# Altium schematic sheet Multiply_2.SchDoc
size A; SheetNumber: 8; SheetTotal: 8
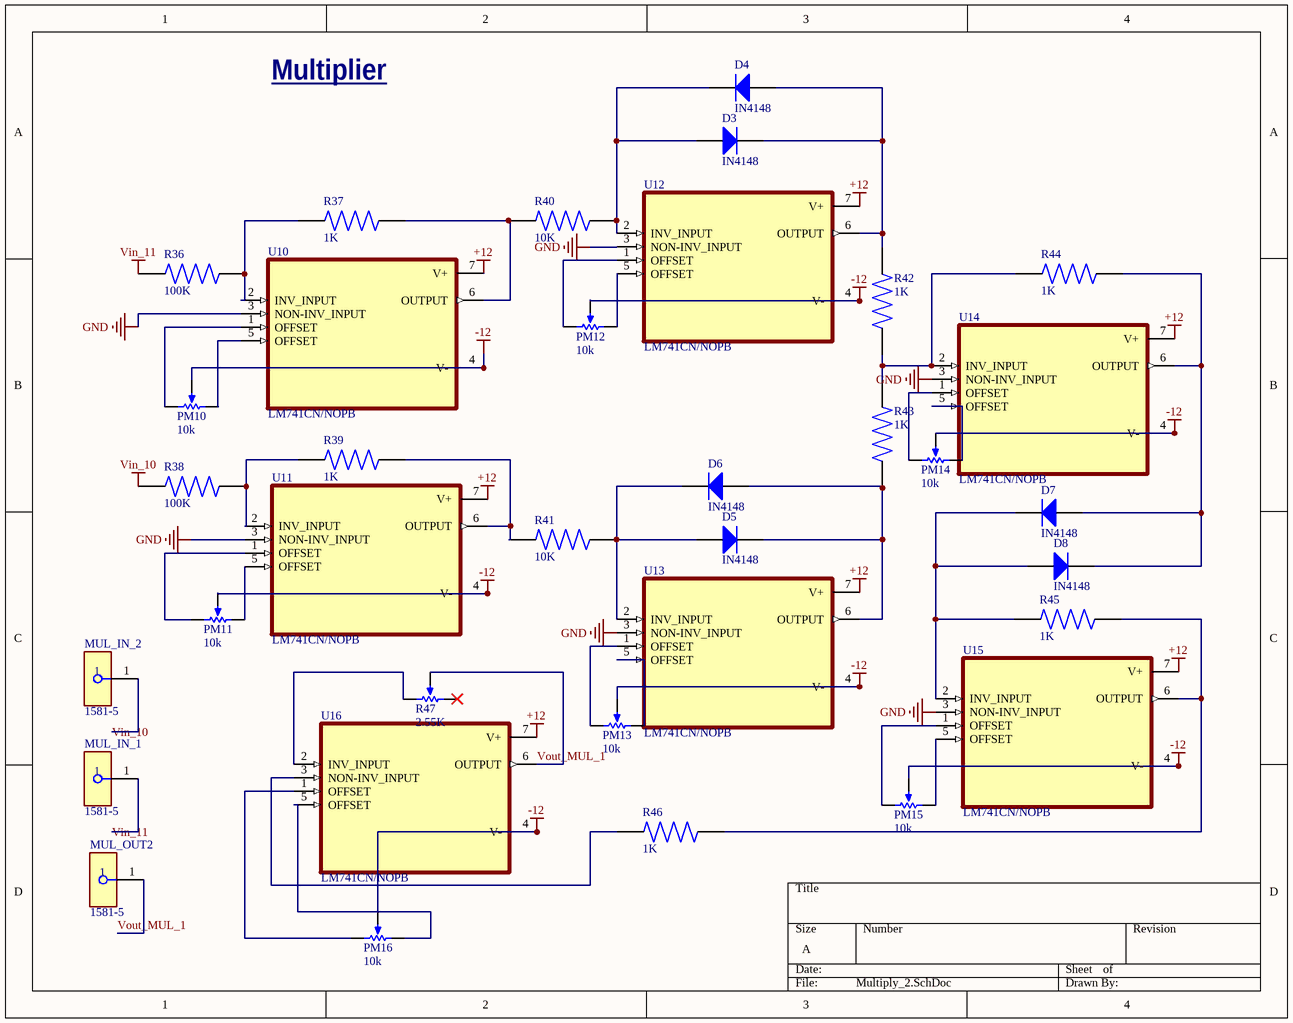
[diagram p0: Multiply_2.SchDoc]

## Parts
D3  IN4148  [PCBComponent_1]
D4  IN4148  [PCBComponent_1]
D5  IN4148  [PCBComponent_1]
D6  IN4148  [PCBComponent_1]
D7  IN4148  [PCBComponent_1]
D8  IN4148  [PCBComponent_1]
MUL_IN_1  1581-5  [FP-1581-5-MFG]
MUL_IN_2  1581-5  [FP-1581-5-MFG]
MUL_OUT2  1581-5  [FP-1581-5-MFG]
PM10  10k  [BOUR-3362P]
PM11  10k  [BOUR-3362P]
PM12  10k  [BOUR-3362P]
PM13  10k  [BOUR-3362P]
PM14  10k  [BOUR-3362P]
PM15  10k  [BOUR-3362P]
PM16  10k  [BOUR-3362P]
R36  100K  [RESAD1100W55L680D260]
R37  1K  [RESAD1100W55L680D260]
R38  100K  [RESAD1100W55L680D260]
R39  1K  [RESAD1100W55L680D260]
R40  10K  [RESAD1100W55L680D260]
R41  10K  [RESAD1100W55L680D260]
R42  1K  [RESAD1100W55L680D260]
R43  1K  [RESAD1100W55L680D260]
R44  1K  [RESAD1100W55L680D260]
R45  1K  [RESAD1100W55L680D260]
R46  1K  [RESAD1100W55L680D260]
R47  2.55K  [BOUR-3852A-282-103AL-3_V]
U10  LM741CN/NOPB  [DIP794W45P254L959H508Q8]
U11  LM741CN/NOPB  [DIP794W45P254L959H508Q8]
U12  LM741CN/NOPB  [DIP794W45P254L959H508Q8]
U13  LM741CN/NOPB  [DIP794W45P254L959H508Q8]
U14  LM741CN/NOPB  [DIP794W45P254L959H508Q8]
U15  LM741CN/NOPB  [DIP794W45P254L959H508Q8]
U16  LM741CN/NOPB  [DIP794W45P254L959H508Q8]

## Nets
+12: U10.7(V+) U11.7(V+) U12.7(V+) U13.7(V+) U14.7(V+) U15.7(V+) U16.7(V+)
-12: PM10.2(S) PM11.2(S) PM12.2(S) PM13.2(S) PM14.2(S) PM15.2(S) PM16.1(CCW) PM16.2(S) U10.4(V-) U11.4(V-) U12.4(V-) U13.4(V-) U14.4(V-) U15.4(V-) U16.4(V-) U16.5(OFFSET)
GND: U10.3(NON-INV_INPUT) U11.3(NON-INV_INPUT) U12.3(NON-INV_INPUT) U13.3(NON-INV_INPUT) U14.3(NON-INV_INPUT) U15.3(NON-INV_INPUT)
Vin_10: MUL_IN_2.1 R38.1
Vin_11: MUL_IN_1.1 R36.1
Vout_MUL_1: MUL_OUT2.1 R47.2(S) U16.6(OUTPUT)
NetD3_1: D3.1(K) D4.2(A) R42.1 U12.6(OUTPUT)
NetD3_2: D3.2(A) D4.1(K) R40.2 U12.2(INV_INPUT)
NetD5_1: D5.1(K) D6.2(A) R43.1 U13.6(OUTPUT)
NetD5_2: D5.2(A) D6.1(K) R41.2 U13.2(INV_INPUT)
NetD7_1: D7.1(K) D8.2(A) R45.1 U15.2(INV_INPUT)
NetD7_2: D7.2(A) D8.1(K) R44.2 U14.6(OUTPUT)
NetPM10_1: PM10.1(CCW) U10.5(OFFSET)
NetPM10_3: PM10.3(CW) U10.1(OFFSET)
NetPM11_1: PM11.1(CCW) U11.5(OFFSET)
NetPM11_3: PM11.3(CW) U11.1(OFFSET)
NetPM12_1: PM12.1(CCW) U12.5(OFFSET)
NetPM12_3: PM12.3(CW) U12.1(OFFSET)
NetPM13_1: PM13.1(CCW) U13.5(OFFSET)
NetPM13_3: PM13.3(CW) U13.1(OFFSET)
NetPM14_1: PM14.1(CCW) U14.5(OFFSET)
NetPM14_3: PM14.3(CW) U14.1(OFFSET)
NetPM15_1: PM15.1(CCW) U15.5(OFFSET)
NetPM15_3: PM15.3(CW) U15.1(OFFSET)
NetPM16_3: PM16.3(CW) U16.1(OFFSET)
NetR36_2: R36.2 R37.1 U10.2(INV_INPUT)
NetR37_2: R37.2 R40.1 U10.6(OUTPUT)
NetR38_2: R38.2 R39.1 U11.2(INV_INPUT)
NetR39_2: R39.2 R41.1 U11.6(OUTPUT)
NetR42_2: R42.2 R43.2 R44.1 U14.2(INV_INPUT)
NetR45_2: R45.2 R46.2 U15.6(OUTPUT)
NetR46_1: R46.1 U16.3(NON-INV_INPUT)
NetR47_3: R47.3(CW) U16.2(INV_INPUT)

Not connected (* = marked no-connect by the designer): R47 1(CCW)*

## Notes on the sheet
- Multiplier

## Library data of the parts
D3-D8 = Component_1
MUL_IN_1 MUL_IN_2 MUL_OUT2 = CMP-73906-000011-1: CONN BANANA JACK TURRET GREEN; Body Material: PC; Number of Contacts: 1; Max Current Rating: 15A; Voltage Rating (AC): 30V; Insulation: Mating End Insulated; Voltage Rating: 2.5kV; Voltage Rating (DC): 60V; Gender: Female; Height: 0.25inch; Mount: Panel; RoHS Compliant: Yes; Length: 1.22inch; Orientation: Straight; Diameter: 4.22mm; Lead Free: Lead Free; Package Quantity: 1; Termination: Turret; Current Rating: 15A; Packaging: Bag; Series: 1581; REACH SVHC: No SVHC; Number of Positions: 1; Contact Plating: Tin; Housing Color: Green; Contact Material: Brass; Insulation Material: Polycarbonate; Weight: 0.126lb; Number of Ports: 1; Color: Green; Housing Material: Polycarbonate; Width: 4inch
PM10-PM16 = CMP-1747-00004-1: Square Trimpot(R) Trimming Potentiometer, 10 KOhm, 300 V, -55 to 125 degC, 3-Pin THD, RoHS, Tube; Voltage Rating: 220 mV; Power Rating: 1 W; Tolerance: 1%; Resistance: 50 mohm; Case/Package: 1206; Length: 3.2 mm; RoHSCompliant: True; PackageDescription: 3-Pin Through Hole Device, Body 6.6 x 6.99 mm, Pitch 2.54 mm; ComponentLink2Description: Datasheet; REACH SVHC: No SVHC; Mount: Surface Mount; Height: 0.6 mm; Packaging: Tape and Reel; ComponentLink1URL: http://www.bourns.com/; Case Code (Imperial): 0612; Pins: 2; Case Code (Metric): 1632; ComponentLink2URL: http://www.bourns.com/docs/Product-Datasheets/3362.pdf; Min Operating Temperature: -25degC; ComponentLink1Description: Manufacturer URL; PackageReference: 3326P; Max Operating Temperature: 125degC; Width: 1.6 mm; Package Quantity: 5000; DatasheetVersion: May-16
R36-R46 = MFR-25FBF52-1K: 1.07 kOhms Â±1% 0.25W, 1/4W Through Hole Resistor Axial - Metal Film; MF: Yageo; SnapEDA_Link: https://www.snapeda.com/parts/MFR-25FBF52-1K/Yageo/view-part/?ref=snap; Package: RADIAL-2 YAGEO; Value: *; MP: MFR-25FBF52-1K; Check_prices: https://www.snapeda.com/parts/MFR-25FBF52-1K/Yageo/view-part/?ref=eda
R47 = CMP-2000-05079-1: Diameter Panel Control, 10 KOhm, +/- 10%, 2 W, -1 to 125 degC, 3-Pin THD, RoHS, Bulk; Manufacturer: Bourns; Temperature Coefficient: ±150ppm/degC; Number of Gangs: 1; Other Names: 3852A282103AL; Actuator Length: 0.875"(22.23mm); Resistive Material: Cermet; PCN Design/Specification: PBTResinJun/2011; Rotation: 280deg; PCN Other: MultipleChanges01/Dec/2012; Catalog Drawings: 3852SeriesSide1 / 3852SeriesSide2; Online Catalog: 3852and3856Series; Associated Product: 36-8560-ND / -KNOBINSTRUMW/DIALRND.9"DIA / 36-8555-ND / -KNOBINSTRUMSKIRTEDRND.7"DIA / 36-8556-ND / -KNOBINSTRUMSKIRTEDRND.9"DIA / 36-8565-ND / -KNOBINSTRUMDBLBARRND.7"DIA / 36-8566-ND / -KNOBINSTRUMDBLBARRND.9"DIA / 36-8568-ND / -KNOBINSTRUMSGLBARRND.7"DIA / 36-8569-ND / -KNOBINSTRUMSGLBARRND.9"DIA / 36-8559-ND / -KNOBINSTRUMW/DIALRND.7"DIA / 226-1006-ND / -KNOBBLKGLOSS.75"DIA.250"SHAFT / 226-1007-ND / -KNOBBLKGLOSS.925"DIA.250"SHAFT / 226-1011-ND / -KNOBBLKGLOS; Actuator Diameter: 0.250"(6.35mm); Built in Switch: None; Resistance (Ohms): 10k; Power (Watts): 2W; Actuator Type: Slotted; Standard Package: 45; Tolerance: ±10%; Taper: Linear; Series: 3852; Packaging: Bulk; Category: Potentiometers,VariableResistors; Bushing Thread: 3/8-32; Datasheet URL: https://datasheet.ciiva.com/11831/0900766b80f93b4b-11831016.pdf; Datasheet Version: Sep-14; Number of Turns: 1; Family: RotaryPotentiometers,Rheostats; Termination Style: SolderLug; RoHS Information: 3852A-LMaterialDeclaration; Mounting Type: PanelMount; Manufacturer URL: http://www.bourns.com/
U10-U16 = LM741CN/NOPB: Single, 44-V, 1-MHz operational amplifier; MF: Texas Instruments; SnapEDA_Link: https://www.snapeda.com/parts/LM741CN/NOPB/Texas+Instruments/view-part/?ref=snap; Package: PDIP-8 Texas; Value: *; MP: LM741CN/NOPB; Check_prices: https://www.snapeda.com/parts/LM741CN/NOPB/Texas+Instruments/view-part/?ref=eda